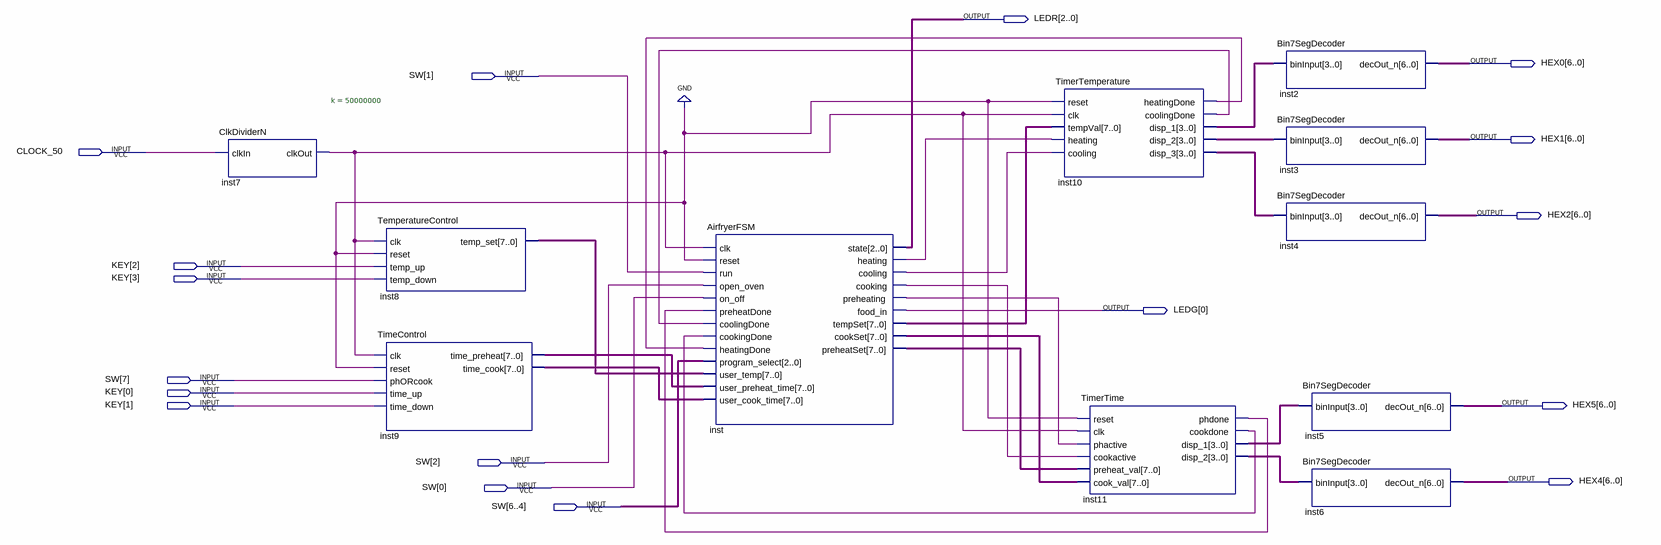
[diagram p0: schematic sheet]
// Quartus schematic AifryerController.bdf as structural Verilog: 11 symbols, 17 pins
module AifryerController (
  input  [7:0] SW,
  input  CLOCK_50,
  input  [3:0] KEY,
  output [2:0] LEDR,
  output [6:0] HEX0,
  output [6:0] HEX1,
  output [6:0] HEX2,
  output [0:0] LEDG,
  output [6:0] HEX5,
  output [6:0] HEX4
);

  wire inst7_clkout, inst10_coolingdone, inst10_heatingdone, inst11_cookdone, inst11_phdone, inst_cooking,
       inst_cooling, inst_heating, inst_preheating;
  wire [3:0] inst10_disp_1, inst10_disp_2, inst10_disp_3, inst11_disp_1, inst11_disp_2;
  wire [7:0] inst8_temp_set, inst9_time_cook, inst9_time_preheat, inst_cookset, inst_preheatset, inst_tempset;

  ClkDividerN #(.k(50000000)) inst7 (.clkIn(CLOCK_50), .clkOut(inst7_clkout));
  TemperatureControl inst8 (
    .clk(inst7_clkout), .reset(1'b0), .temp_up(KEY[2]), .temp_down(KEY[3]), .temp_set(inst8_temp_set));
  TimeControl inst9 (
    .clk(inst7_clkout), .reset(1'b0), .phORcook(SW[7]), .time_up(KEY[0]), .time_down(KEY[1]),
    .time_preheat(inst9_time_preheat), .time_cook(inst9_time_cook));
  AirfryerFSM inst (
    .clk(inst7_clkout), .reset(1'b0), .run(SW[1]), .open_oven(SW[2]), .on_off(SW[0]),
    .preheatDone(inst11_phdone), .coolingDone(inst10_coolingdone), .cookingDone(inst11_cookdone),
    .heatingDone(inst10_heatingdone), .program_select(SW[6:4]), .user_temp(inst8_temp_set),
    .user_preheat_time(inst9_time_preheat), .user_cook_time(inst9_time_cook), .state(LEDR),
    .heating(inst_heating), .cooling(inst_cooling), .cooking(inst_cooking), .preheating(inst_preheating),
    .food_in(LEDG[0]), .tempSet(inst_tempset), .cookSet(inst_cookset), .preheatSet(inst_preheatset));
  TimerTemperature inst10 (
    .reset(1'b0), .clk(inst7_clkout), .tempVal(inst_tempset), .heating(inst_heating), .cooling(inst_cooling),
    .heatingDone(inst10_heatingdone), .coolingDone(inst10_coolingdone), .disp_1(inst10_disp_1),
    .disp_2(inst10_disp_2), .disp_3(inst10_disp_3));
  TimerTime inst11 (
    .reset(1'b0), .clk(inst7_clkout), .phactive(inst_preheating), .cookactive(inst_cooking),
    .preheat_val(inst_preheatset), .cook_val(inst_cookset), .phdone(inst11_phdone),
    .cookdone(inst11_cookdone), .disp_1(inst11_disp_1), .disp_2(inst11_disp_2));
  Bin7SegDecoder inst2 (.binInput(inst10_disp_1), .decOut_n(HEX0));
  Bin7SegDecoder inst3 (.binInput(inst10_disp_2), .decOut_n(HEX1));
  Bin7SegDecoder inst4 (.binInput(inst10_disp_3), .decOut_n(HEX2));
  Bin7SegDecoder inst5 (.binInput(inst11_disp_1), .decOut_n(HEX5));
  Bin7SegDecoder inst6 (.binInput(inst11_disp_2), .decOut_n(HEX4));
endmodule
